# Altium project PA_8CH.PrjPcb (part 3 of 3)
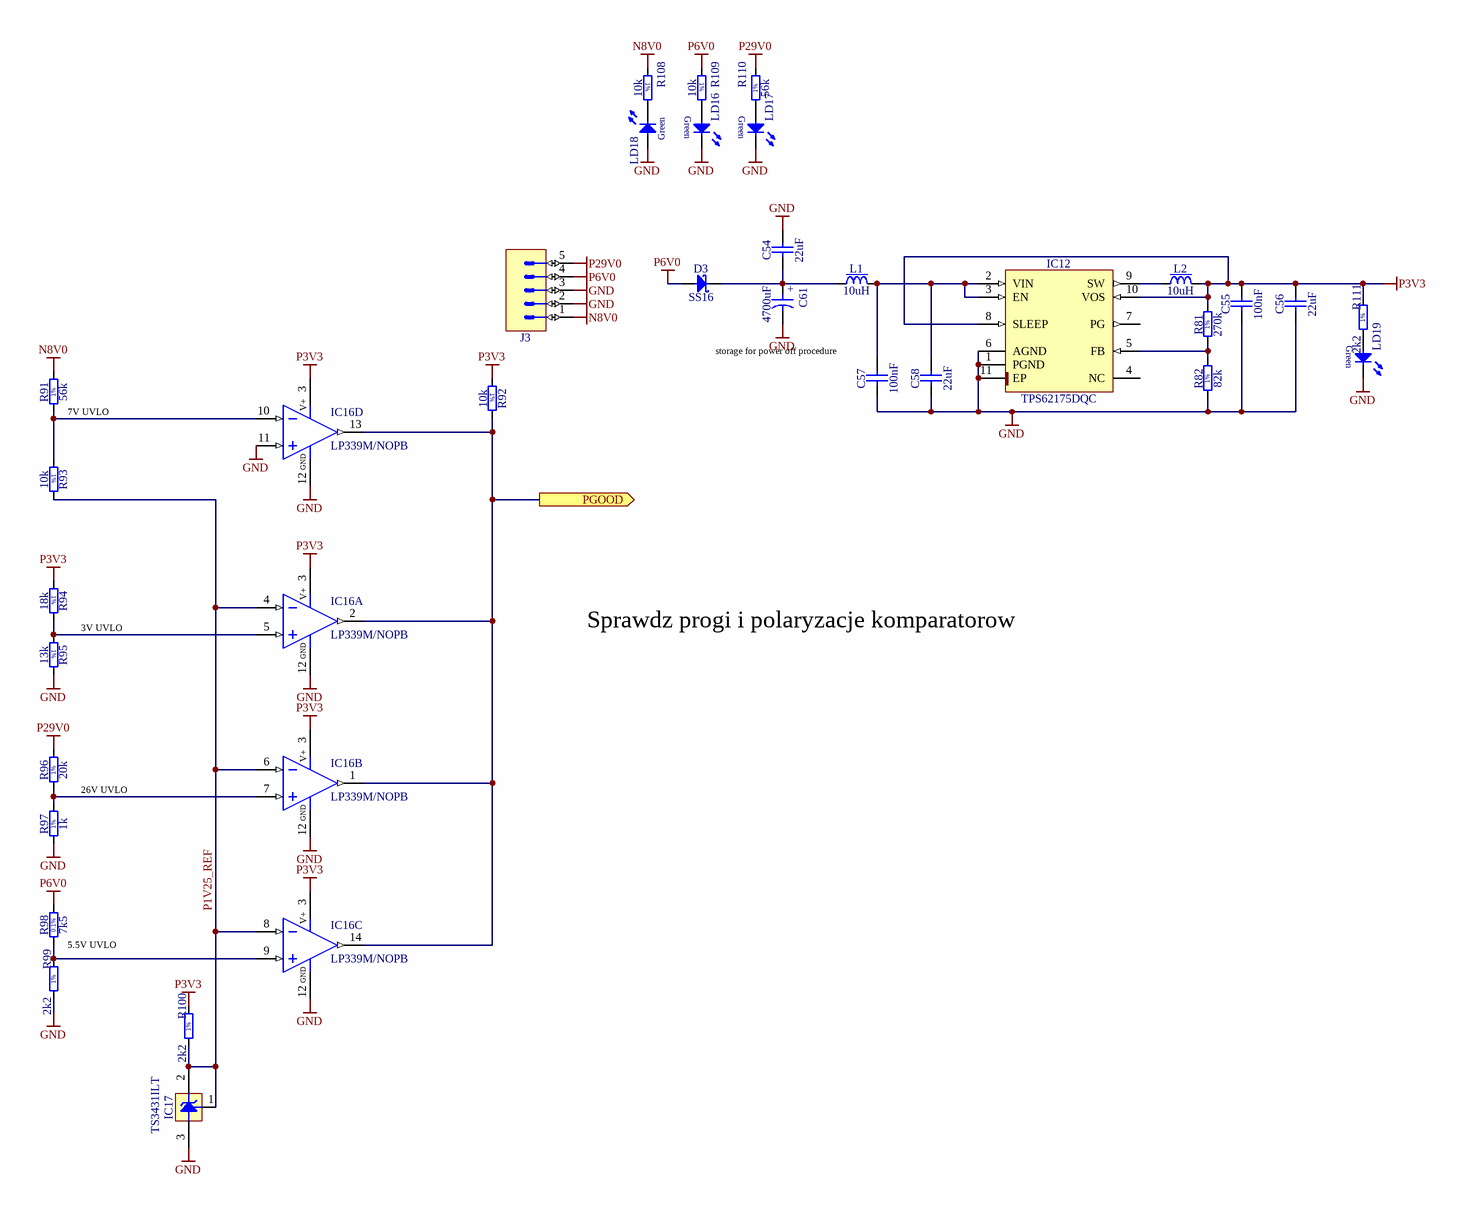
[diagram p6: Power_Supply.SchDoc]

## Nets that join several sheets
GND: CPU_ETH (35 pins), PA_CTRL_TOP (39 pins), ETH_IFC (24 pins), U_PA_Channel (42 pins), U_PA_Channel (42 pins), U_PA_Channel (42 pins), U_PA_Channel (42 pins), U_PA_Channel (42 pins), U_PA_Channel (42 pins), U_PA_Channel (42 pins), U_PA_Channel (42 pins), LEDs (27 pins), Power_Supply (22 pins)
N8V0: U_PA_Channel (C42_1.2 IC13_1.2), U_PA_Channel (C42_2.2 IC13_2.2), U_PA_Channel (C42_3.2 IC13_3.2), U_PA_Channel (C42_4.2 IC13_4.2), U_PA_Channel (C42_5.2 IC13_5.2), U_PA_Channel (C42_6.2 IC13_6.2), U_PA_Channel (C42_7.2 IC13_7.2), U_PA_Channel (C42_8.2 IC13_8.2), Power_Supply (J3.1 R91.2 R108.1)
P3V3: CPU_ETH (31 pins), PA_CTRL_TOP (26 pins), ETH_IFC (8 pins), U_PA_Channel (16 pins), U_PA_Channel (16 pins), U_PA_Channel (16 pins), U_PA_Channel (16 pins), U_PA_Channel (16 pins), U_PA_Channel (16 pins), U_PA_Channel (16 pins), U_PA_Channel (16 pins), LEDs (6 pins), Power_Supply (11 pins)
P6V0: U_PA_Channel (C35_1.2 R42_1.1 T3_1.2), U_PA_Channel (C35_2.2 R42_2.1 T3_2.2), U_PA_Channel (C35_3.2 R42_3.1 T3_3.2), U_PA_Channel (C35_4.2 R42_4.1 T3_4.2), U_PA_Channel (C35_5.2 R42_5.1 T3_5.2), U_PA_Channel (C35_6.2 R42_6.1 T3_6.2), U_PA_Channel (C35_7.2 R42_7.1 T3_7.2), U_PA_Channel (C35_8.2 R42_8.1 T3_8.2), Power_Supply (D3.2 J3.4 R98.2 R109.1)
P29V0: U_PA_Channel (C32_1.2 R40_1.2 T1_1.2), U_PA_Channel (C32_2.2 R40_2.2 T1_2.2), U_PA_Channel (C32_3.2 R40_3.2 T1_3.2), U_PA_Channel (C32_4.2 R40_4.2 T1_4.2), U_PA_Channel (C32_5.2 R40_5.2 T1_5.2), U_PA_Channel (C32_6.2 R40_6.2 T1_6.2), U_PA_Channel (C32_7.2 R40_7.2 T1_7.2), U_PA_Channel (C32_8.2 R40_8.2 T1_8.2), Power_Supply (J3.5 R96.2 R110.2)
I2C0_SCL: PA_CTRL_TOP (IC11.2 R63.1), U_PA_Channel (CON1_1.9 IC9_1.3 IC15_1.5)
I2C0_SDA: PA_CTRL_TOP (IC11.1 R61.1), U_PA_Channel (CON1_1.4 IC9_1.4 IC15_1.4)
I2C1_SCL: PA_CTRL_TOP (IC11.4 R65.1), U_PA_Channel (CON1_2.9 IC9_2.3 IC15_2.5)
I2C1_SDA: PA_CTRL_TOP (IC11.3 R64.1), U_PA_Channel (CON1_2.4 IC9_2.4 IC15_2.4)
I2C2_SCL: PA_CTRL_TOP (IC11.6 R70.1), U_PA_Channel (CON1_3.9 IC9_3.3 IC15_3.5)
I2C2_SDA: PA_CTRL_TOP (IC11.5 R68.1), U_PA_Channel (CON1_3.4 IC9_3.4 IC15_3.4)
I2C3_SCL: PA_CTRL_TOP (IC11.8 R72.1), U_PA_Channel (CON1_4.9 IC9_4.3 IC15_4.5)
I2C3_SDA: PA_CTRL_TOP (IC11.7 R71.1), U_PA_Channel (CON1_4.4 IC9_4.4 IC15_4.4)
I2C4_SCL: PA_CTRL_TOP (IC11.11 R74.1), U_PA_Channel (CON1_5.9 IC9_5.3 IC15_5.5)
I2C4_SDA: PA_CTRL_TOP (IC11.10 R73.1), U_PA_Channel (CON1_5.4 IC9_5.4 IC15_5.4)
I2C5_SCL: PA_CTRL_TOP (IC11.13 R76.1), U_PA_Channel (CON1_6.9 IC9_6.3 IC15_6.5)
I2C5_SDA: PA_CTRL_TOP (IC11.12 R75.1), U_PA_Channel (CON1_6.4 IC9_6.4 IC15_6.4)
I2C6_SCL: PA_CTRL_TOP (IC11.15 R78.1), U_PA_Channel (CON1_7.9 IC9_7.3 IC15_7.5)
I2C6_SDA: PA_CTRL_TOP (IC11.14 R77.1), U_PA_Channel (CON1_7.4 IC9_7.4 IC15_7.4)
I2C7_SCL: PA_CTRL_TOP (IC11.17 R80.1), U_PA_Channel (CON1_8.9 IC9_8.3 IC15_8.5)
I2C7_SDA: PA_CTRL_TOP (IC11.16 R79.1), U_PA_Channel (CON1_8.4 IC9_8.4 IC15_8.4)
INT: PA_CTRL_TOP (J4.12), ETH_IFC (U1.36)
LED_CS: PA_CTRL_TOP (J4.14), LEDs (IC3.12 IC4.12 IC5.12)
LED_OEn: PA_CTRL_TOP (J4.18), LEDs (IC3.13 IC4.13 IC5.13)
LED_SCK: PA_CTRL_TOP (J4.16), LEDs (IC3.11 IC4.11 IC5.11)
LED_SDI: PA_CTRL_TOP (J4.17), LEDs (IC3.14)
NetD2_1_1: U_PA_Channel (D2_1.1), U_PA_Channel (D2_2.1), U_PA_Channel (D2_3.1), U_PA_Channel (D2_4.1), U_PA_Channel (D2_5.1), U_PA_Channel (D2_6.1), U_PA_Channel (D2_7.1), U_PA_Channel (D2_8.1), Power_Supply (5 pins)
P2V5_REF: PA_CTRL_TOP (C52.1 IC10.2), U_PA_Channel (C51_1.1 IC9_1.15), U_PA_Channel (C51_2.1 IC9_2.15), U_PA_Channel (C51_3.1 IC9_3.15), U_PA_Channel (C51_4.1 IC9_4.15), U_PA_Channel (C51_5.1 IC9_5.15), U_PA_Channel (C51_6.1 IC9_6.15), U_PA_Channel (C51_7.1 IC9_7.15), U_PA_Channel (C51_8.1 IC9_8.15)
PA_CH_RESETn: U_PA_Channel (IC9_1.1), U_PA_Channel (IC9_2.1), U_PA_Channel (IC9_3.1), U_PA_Channel (IC9_4.1), U_PA_Channel (IC9_5.1), U_PA_Channel (IC9_6.1), U_PA_Channel (IC9_7.1), U_PA_Channel (IC9_8.1)
PA_SIG_GND: U_PA_Channel (CON1_1.15), U_PA_Channel (CON1_2.15), U_PA_Channel (CON1_3.15), U_PA_Channel (CON1_4.15), U_PA_Channel (CON1_5.15), U_PA_Channel (CON1_6.15), U_PA_Channel (CON1_7.15), U_PA_Channel (CON1_8.15)
RESETn: PA_CTRL_TOP (J4.10), ETH_IFC (U1.37)
SPI1_MISO: PA_CTRL_TOP (J4.8), ETH_IFC (U1.34)
SPI1_MOSI: PA_CTRL_TOP (J4.6), ETH_IFC (U1.35)
SPI1_NSS: PA_CTRL_TOP (J4.2), ETH_IFC (U1.32)
SPI1_SCK: PA_CTRL_TOP (J4.4), ETH_IFC (U1.33)